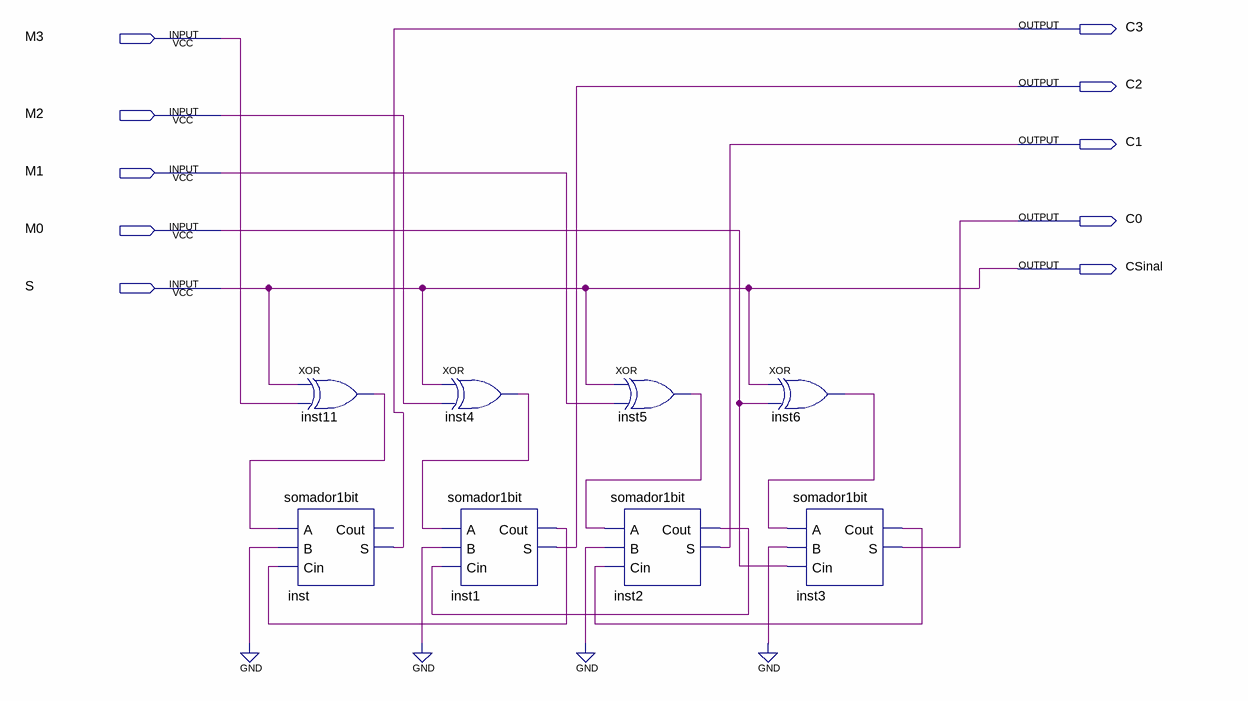
[diagram p0: schematic sheet]
// Quartus schematic conversorEntrada.bdf as structural Verilog: 8 symbols, 10 pins
module conversorEntrada (
  input  M3,
  input  M2,
  input  M1,
  input  M0,
  input  S,
  output C3,
  output C2,
  output C1,
  output C0,
  output CSinal
);

  wire inst1_cout, inst2_cout, inst3_cout, inst4_out, inst5_out, inst6_out, inst11_out;

  xor inst11 (inst11_out, S, M3);
  somador1bit inst (.A(inst11_out), .B(1'b0), .Cin(inst1_cout), .S(C3));  // open: Cout
  xor inst4 (inst4_out, S, M2);
  somador1bit inst1 (.A(inst4_out), .B(1'b0), .Cin(inst2_cout), .Cout(inst1_cout), .S(C2));
  somador1bit inst2 (.A(inst5_out), .B(1'b0), .Cin(inst3_cout), .Cout(inst2_cout), .S(C1));
  xor inst5 (inst5_out, S, M1);
  xor inst6 (inst6_out, S, M0);
  somador1bit inst3 (.A(inst6_out), .B(1'b0), .Cin(M0), .Cout(inst3_cout), .S(C0));

  assign CSinal = S;
endmodule
